# Altium schematic sheet ZX_Main.SchDoc
size A3
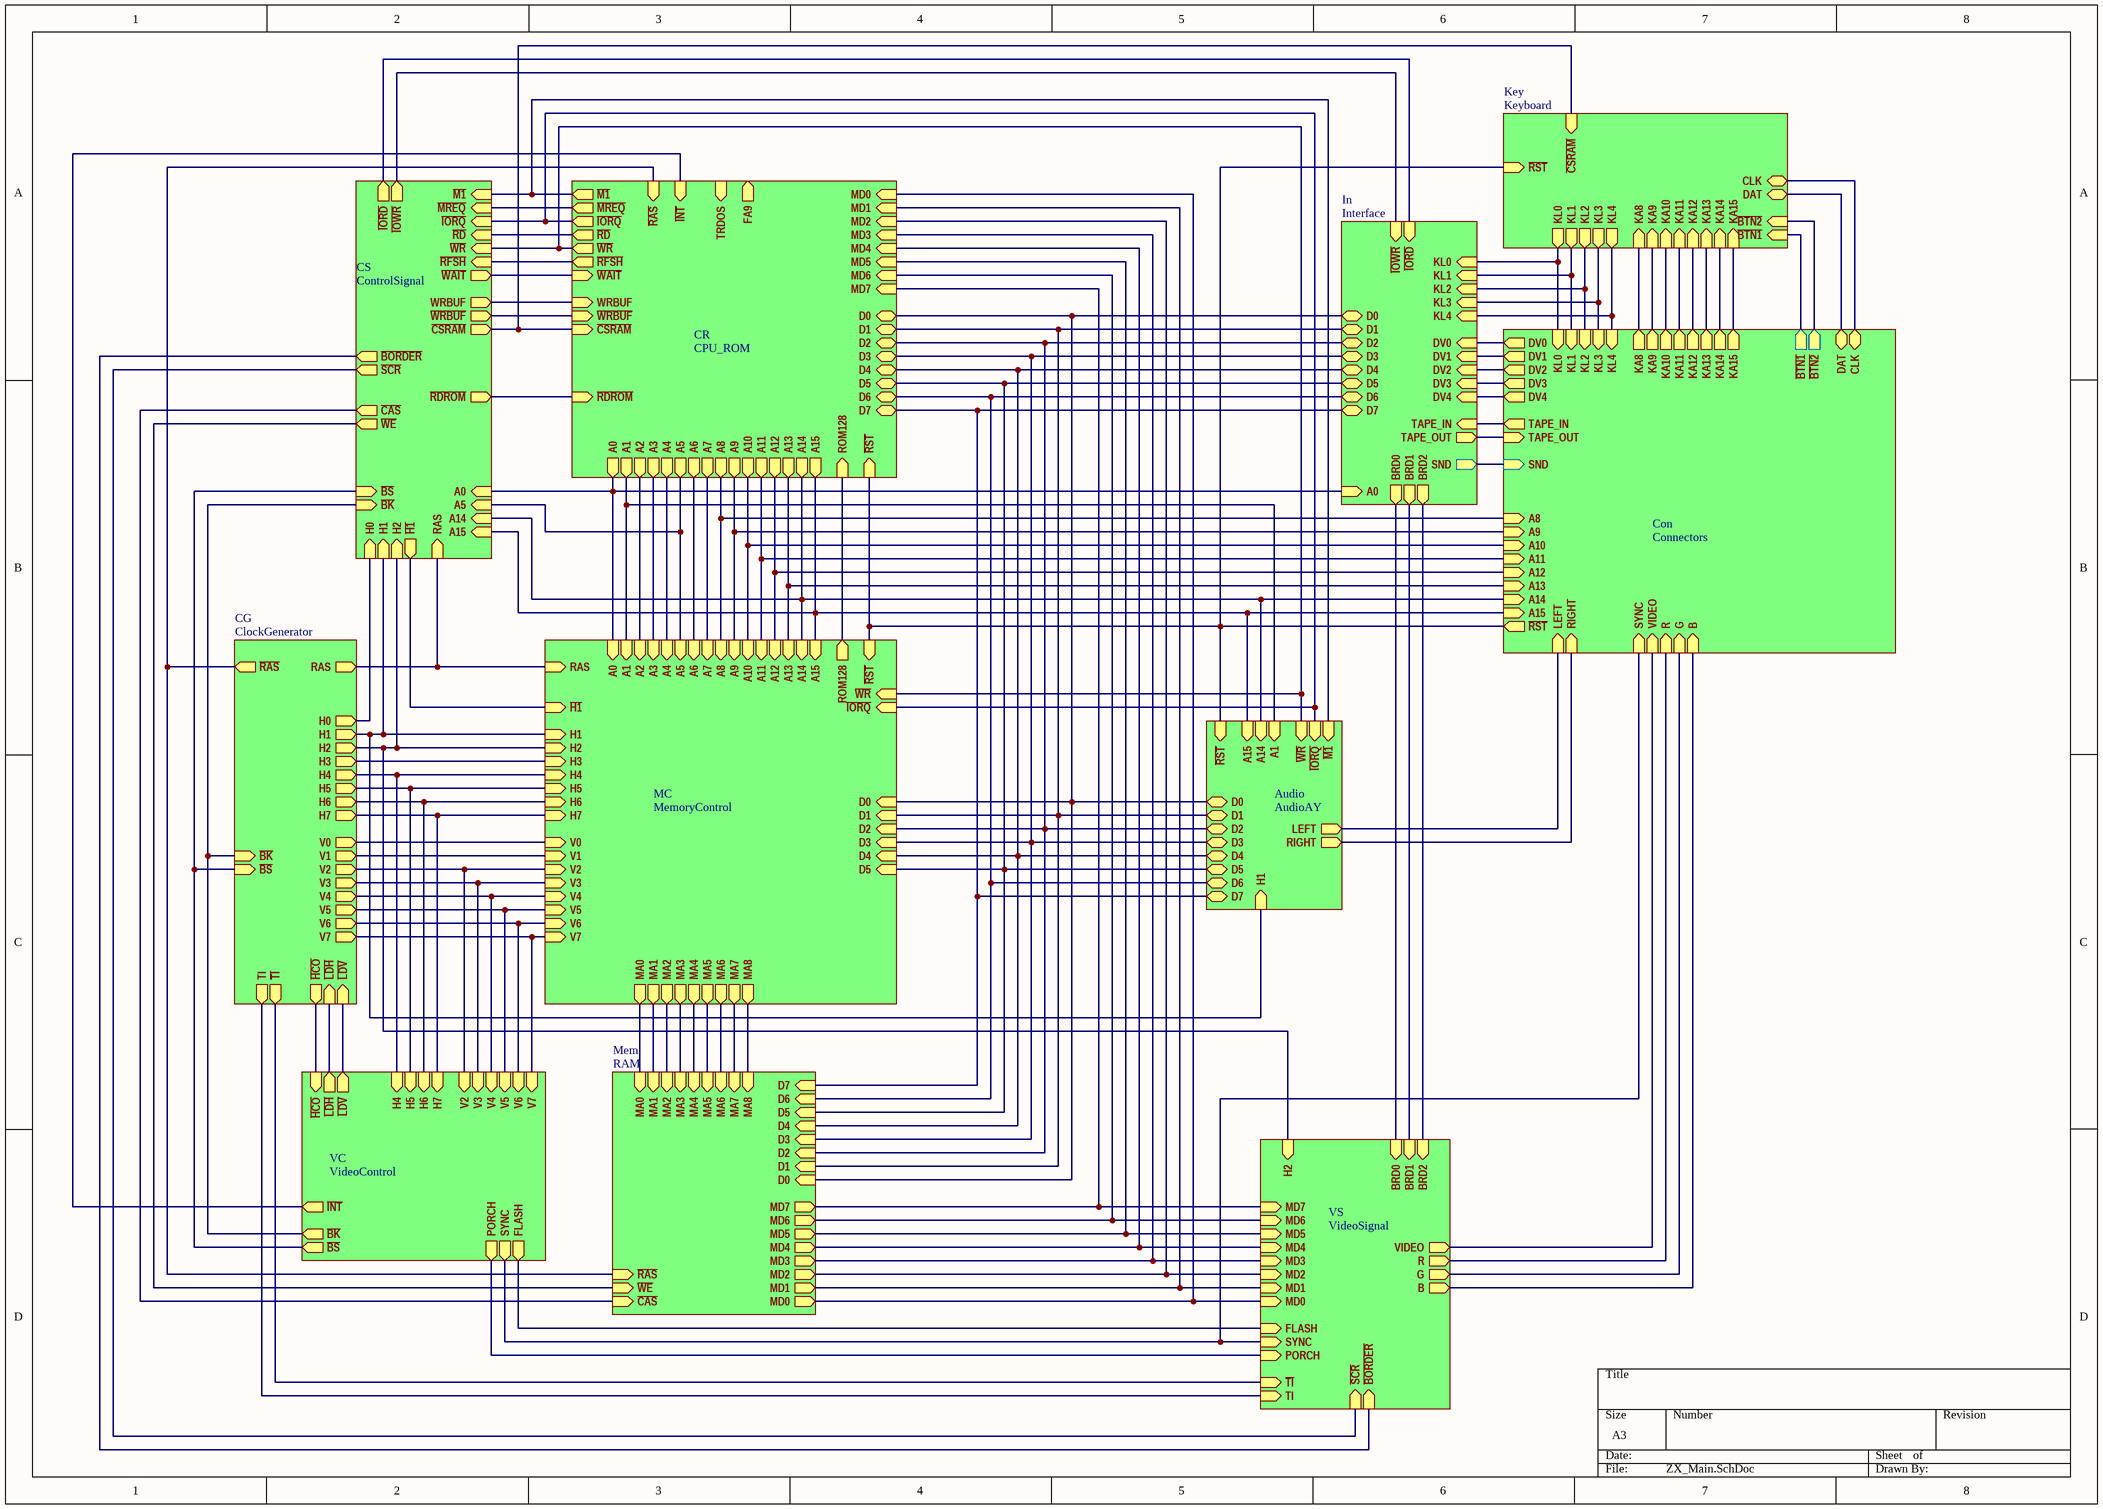
[diagram p0: ZX_Main.SchDoc]

## Sub-sheets
Audio = AudioAY: A15 (in), ~{IORQ} (in), ~{WR} (in), A14 (in), A1 (in), ~{M1} (in), D5 (bidir), D0 (bidir), D6 (bidir), D7 (bidir), D4 (bidir), D3 (bidir), D2 (bidir), D1 (bidir), H1 (in), ~{RST} (in), RIGHT (out), LEFT (out)
CG = ClockGenerator: TI (out), H5 (out), ~{HCO} (out), V5 (out), V4 (out), V7 (out), V0 (out), H2 (out), H0 (out), ~{LDH} (in), H7 (out), ~{RAS} (out), V3 (out), H1 (out), H3 (out), V2 (out), V6 (out), ~{TI} (out), H6 (out), H4 (out), ~{LDV} (in), RAS (out), ~{BK} (in), ~{BS} (in), V1 (out)
Con = Connectors: VIDEO (in), B (in), G (in), R (in), KA14 (out), SYNC (in), ~{RST} (out), LEFT (in), RIGHT (in), DAT (bidir), CLK (bidir), TAPE_IN (out), TAPE_OUT (in), KA15 (out), KA10 (out), KA12 (out), KA11 (out), KA13 (out), KA9 (out), A9 (in), A15 (in), A8 (in), A13 (in), A14 (in), A12 (in), A11 (in), A10 (in), KA8 (out), DV0 (out), DV1 (out), DV4 (out), DV3 (out), DV2 (out), ~{BTN1} (out), ~{BTN2} (out), KL0 (in), KL4 (in), KL1 (in), KL3 (in), KL2 (in), SND (in)
CR = CPU_ROM: ~{RD} (out), ~{WAIT} (in), A0 (out), ~{RDROM} (in), ~{RAS} (in), ~{M1} (out), ~{INT} (in), ~{RFSH} (out), ~{WR} (out), ~{MREQ} (out), ~{RST} (in), MD7 (in), MD6 (in), MD5 (in), MD4 (in), MD3 (in), MD2 (in), MD1 (in), MD0 (in), ~{WRBUF} (in), WRBUF (in), ~{CSRAM} (in), FA9 (out), ~{IORQ} (out), TRDOS (in), ROM128 (in), D7 (bidir), D6 (bidir), D5 (bidir), D4 (bidir), D3 (bidir), D2 (bidir), D1 (bidir), D0 (bidir), A15 (out), A14 (out), A13 (out), A12 (out), A11 (out), A10 (out), A9 (out), A8 (out), A7 (out), A6 (out), A2 (out), A1 (out), A5 (out), A4 (out), A3 (out)
CS = ControlSignal: ~{BS} (in), ~{BK} (in), H0 (in), H1 (in), H2 (in), ~{BORDER} (out), ~{SCR} (out), ~{CAS} (out), ~{WRBUF} (out), WRBUF (out), ~{RD} (in), ~{RFSH} (in), RAS (in), ~{H1} (out), ~{MREQ} (in), A14 (in), A15 (in), ~{WE} (out), ~{RDROM} (out), ~{CSRAM} (out), ~{M1} (in), ~{WAIT} (out), A0 (in), A5 (in), ~{IORQ} (in), ~{WR} (in), ~{IORD} (out), ~{IOWR} (out)
In = Interface: A0 (in), ~{IORD} (in), KL0 (in), KL1 (in), KL2 (in), KL3 (in), KL4 (in), DV0 (in), DV1 (in), DV2 (in), D0, D1, D2, DV3 (in), DV4 (in), D3, D4, D5, D6, D7, ~{IOWR} (in), BRD0 (out), BRD1 (out), BRD2 (out), TAPE_IN (in), TAPE_OUT (out), SND (out)
Key = Keyboard: KA13 (in), ~{CSRAM} (in), KA15 (in), KL2 (out), ~{RST} (in), KA12 (in), KL3 (out), KA14 (in), KL4 (out), KA8 (in), KA11 (in), CLK (bidir), ~{BTN1} (in), KA10 (in), KA9 (in), DAT (bidir), ~{BTN2} (in), KL0 (out), KL1 (out)
MC = MemoryControl: MA1 (out), MA0 (out), MA8 (out), V4 (in), MA4 (out), MA3 (out), RAS (in), V2 (in), ~{H1} (in), MA7 (out), A1 (in), H5 (in), V1 (in), H1 (in), H2 (in), V3 (in), MA6 (out), V0 (in), MA5 (out), V7 (in), V6 (in), H6 (in), MA2 (out), V5 (in), A0 (in), H7 (in), H4 (in), H3 (in), A2 (in), A3 (in), A4 (in), A5 (in), A6 (in), A7 (in), A8 (in), A9 (in), A10 (in), A11 (in), A12 (in), A13 (in), A14 (in), A15 (in), ~{RST} (in), D0 (in), D1 (in), D2 (in), D3 (in), D4 (in), D5 (in), ~{WR} (in), ~{IORQ} (in), ROM128 (out)
Mem = RAM: D6 (in), D1 (in), D0 (in), MD0 (out), D4 (in), MD7 (out), D7 (in), D5 (in), MD3 (out), MD1 (out), D2 (in), D3 (in), MD2 (out), MD4 (out), MD5 (out), MD6 (out), ~{WE} (in), ~{CAS} (in), ~{RAS} (in), MA8 (in), MA7 (in), MA6 (in), MA5 (in), MA4 (in), MA2 (in), MA1 (in), MA0 (in), MA3 (in)
VC = VideoControl: H7 (in), H6 (in), H5 (in), ~{HCO} (in), ~{LDH} (out), ~{BS} (out), PORCH (out), SYNC (out), V4 (in), V7 (in), ~{LDV} (out), H4 (in), V5 (in), V6 (in), V2 (in), V3 (in), ~{BK} (out), FLASH (out), ~{INT} (out)
VS = VideoSignal: H2 (in), MD6 (in), SYNC (in), MD5 (in), MD3 (in), MD1 (in), TI (in), ~{SCR} (in), FLASH (in), ~{TI} (in), MD0 (in), MD2 (in), MD4 (in), PORCH (in), ~{BORDER} (in), MD7 (in), G (out), R (out), B (out), VIDEO (out), BRD2 (in), BRD1 (in), BRD0 (in)

## Nets
(unnamed): sheet CG/TI, sheet VS/TI
(unnamed): sheet CG/H5, sheet VC/H5, sheet MC/H5
(unnamed): sheet CG/~{HCO}, sheet VC/~{HCO}
(unnamed): sheet CG/V5, sheet VC/V5, sheet MC/V5
(unnamed): sheet CG/V4, sheet VC/V4, sheet MC/V4
(unnamed): sheet CG/V7, sheet VC/V7, sheet MC/V7
(unnamed): sheet CG/V0, sheet MC/V0
(unnamed): sheet CG/H2, sheet CS/H2, sheet VS/H2, sheet MC/H2
(unnamed): sheet CG/H0, sheet CS/H0
(unnamed): sheet CG/~{LDH}, sheet VC/~{LDH}
(unnamed): sheet CG/H7, sheet VC/H7, sheet MC/H7
(unnamed): sheet CG/~{RAS}, sheet CR/~{RAS}, sheet Mem/~{RAS}
(unnamed): sheet CG/V3, sheet VC/V3, sheet MC/V3
(unnamed): sheet CG/H1, sheet CS/H1, sheet MC/H1, sheet Audio/H1
(unnamed): sheet CG/H3, sheet MC/H3
(unnamed): sheet CG/V2, sheet VC/V2, sheet MC/V2
(unnamed): sheet CG/V6, sheet VC/V6, sheet MC/V6
(unnamed): sheet CG/~{TI}, sheet VS/~{TI}
(unnamed): sheet CG/H6, sheet VC/H6, sheet MC/H6
(unnamed): sheet CG/H4, sheet VC/H4, sheet MC/H4
(unnamed): sheet CG/~{LDV}, sheet VC/~{LDV}
(unnamed): sheet CG/RAS, sheet CS/RAS, sheet MC/RAS
(unnamed): sheet CG/~{BK}, sheet CS/~{BK}, sheet VC/~{BK}
(unnamed): sheet CG/~{BS}, sheet CS/~{BS}, sheet VC/~{BS}
(unnamed): sheet CG/V1, sheet MC/V1
(unnamed): sheet CS/~{BORDER}, sheet VS/~{BORDER}
(unnamed): sheet CS/~{SCR}, sheet VS/~{SCR}
(unnamed): sheet CS/~{CAS}, sheet Mem/~{CAS}
(unnamed): sheet CS/~{WRBUF}, sheet CR/~{WRBUF}
(unnamed): sheet CS/WRBUF, sheet CR/WRBUF
(unnamed): sheet CS/~{RD}, sheet CR/~{RD}
(unnamed): sheet CS/~{RFSH}, sheet CR/~{RFSH}
(unnamed): sheet CS/~{H1}, sheet MC/~{H1}
(unnamed): sheet CS/~{MREQ}, sheet CR/~{MREQ}
(unnamed): sheet CS/A14, sheet CR/A14, sheet MC/A14, sheet Audio/A14, sheet Con/A14
(unnamed): sheet CS/A15, sheet CR/A15, sheet MC/A15, sheet Audio/A15, sheet Con/A15
(unnamed): sheet CS/~{WE}, sheet Mem/~{WE}
(unnamed): sheet CS/~{RDROM}, sheet CR/~{RDROM}
(unnamed): sheet CS/~{CSRAM}, sheet CR/~{CSRAM}, sheet Key/~{CSRAM}
(unnamed): sheet CS/~{M1}, sheet CR/~{M1}, sheet Audio/~{M1}
(unnamed): sheet CS/~{WAIT}, sheet CR/~{WAIT}
(unnamed): sheet CS/A0, sheet CR/A0, sheet MC/A0, sheet In/A0
(unnamed): sheet CS/A5, sheet CR/A5, sheet MC/A5
(unnamed): sheet CS/~{IORQ}, sheet CR/~{IORQ}, sheet MC/~{IORQ}, sheet Audio/~{IORQ}
(unnamed): sheet CS/~{WR}, sheet CR/~{WR}, sheet MC/~{WR}, sheet Audio/~{WR}
(unnamed): sheet CS/~{IORD}, sheet In/~{IORD}
(unnamed): sheet CS/~{IOWR}, sheet In/~{IOWR}
(unnamed): sheet VC/PORCH, sheet VS/PORCH
(unnamed): sheet VC/SYNC, sheet VS/SYNC, sheet Con/SYNC
(unnamed): sheet VC/FLASH, sheet VS/FLASH
(unnamed): sheet VC/~{INT}, sheet CR/~{INT}
(unnamed): sheet VS/MD6, sheet CR/MD6, sheet Mem/MD6
(unnamed): sheet VS/MD5, sheet CR/MD5, sheet Mem/MD5
(unnamed): sheet VS/MD3, sheet CR/MD3, sheet Mem/MD3
(unnamed): sheet VS/MD1, sheet CR/MD1, sheet Mem/MD1
(unnamed): sheet VS/MD0, sheet CR/MD0, sheet Mem/MD0
(unnamed): sheet VS/MD2, sheet CR/MD2, sheet Mem/MD2
(unnamed): sheet VS/MD4, sheet CR/MD4, sheet Mem/MD4
(unnamed): sheet VS/MD7, sheet CR/MD7, sheet Mem/MD7
(unnamed): sheet VS/G, sheet Con/G
(unnamed): sheet VS/R, sheet Con/R
(unnamed): sheet VS/B, sheet Con/B
(unnamed): sheet VS/VIDEO, sheet Con/VIDEO
(unnamed): sheet VS/BRD2, sheet In/BRD2
(unnamed): sheet VS/BRD1, sheet In/BRD1
(unnamed): sheet VS/BRD0, sheet In/BRD0
(unnamed): sheet CR/~{RST}, sheet MC/~{RST}, sheet Key/~{RST}, sheet Audio/~{RST}, sheet Con/~{RST}
(unnamed): sheet CR/ROM128, sheet MC/ROM128
(unnamed): sheet CR/D7, sheet Mem/D7, sheet Audio/D7, sheet In/D7
(unnamed): sheet CR/D6, sheet Mem/D6, sheet Audio/D6, sheet In/D6
(unnamed): sheet CR/D5, sheet MC/D5, sheet Mem/D5, sheet Audio/D5, sheet In/D5
(unnamed): sheet CR/D4, sheet MC/D4, sheet Mem/D4, sheet Audio/D4, sheet In/D4
(unnamed): sheet CR/D3, sheet MC/D3, sheet Mem/D3, sheet Audio/D3, sheet In/D3
(unnamed): sheet CR/D2, sheet MC/D2, sheet Mem/D2, sheet Audio/D2, sheet In/D2
(unnamed): sheet CR/D1, sheet MC/D1, sheet Mem/D1, sheet Audio/D1, sheet In/D1
(unnamed): sheet CR/D0, sheet MC/D0, sheet Mem/D0, sheet Audio/D0, sheet In/D0
(unnamed): sheet CR/A13, sheet MC/A13, sheet Con/A13
(unnamed): sheet CR/A12, sheet MC/A12, sheet Con/A12
(unnamed): sheet CR/A11, sheet MC/A11, sheet Con/A11
(unnamed): sheet CR/A10, sheet MC/A10, sheet Con/A10
(unnamed): sheet CR/A9, sheet MC/A9, sheet Con/A9
(unnamed): sheet CR/A8, sheet MC/A8, sheet Con/A8
(unnamed): sheet CR/A7, sheet MC/A7
(unnamed): sheet CR/A6, sheet MC/A6
(unnamed): sheet CR/A2, sheet MC/A2
(unnamed): sheet CR/A1, sheet MC/A1, sheet Audio/A1
(unnamed): sheet CR/A4, sheet MC/A4
(unnamed): sheet CR/A3, sheet MC/A3
(unnamed): sheet MC/MA1, sheet Mem/MA1
(unnamed): sheet MC/MA0, sheet Mem/MA0
(unnamed): sheet MC/MA8, sheet Mem/MA8
(unnamed): sheet MC/MA4, sheet Mem/MA4
(unnamed): sheet MC/MA3, sheet Mem/MA3
(unnamed): sheet MC/MA7, sheet Mem/MA7
(unnamed): sheet MC/MA6, sheet Mem/MA6
(unnamed): sheet MC/MA5, sheet Mem/MA5
(unnamed): sheet MC/MA2, sheet Mem/MA2
(unnamed): sheet Key/KA13, sheet Con/KA13
(unnamed): sheet Key/KA15, sheet Con/KA15
(unnamed): sheet Key/KL2, sheet In/KL2, sheet Con/KL2
(unnamed): sheet Key/KA12, sheet Con/KA12
(unnamed): sheet Key/KL3, sheet In/KL3, sheet Con/KL3
(unnamed): sheet Key/KA14, sheet Con/KA14
(unnamed): sheet Key/KL4, sheet In/KL4, sheet Con/KL4
(unnamed): sheet Key/KA8, sheet Con/KA8
(unnamed): sheet Key/KA11, sheet Con/KA11
(unnamed): sheet Key/CLK, sheet Con/CLK
(unnamed): sheet Key/~{BTN1}, sheet Con/~{BTN1}
(unnamed): sheet Key/KA10, sheet Con/KA10
(unnamed): sheet Key/KA9, sheet Con/KA9
(unnamed): sheet Key/DAT, sheet Con/DAT
(unnamed): sheet Key/~{BTN2}, sheet Con/~{BTN2}
(unnamed): sheet Key/KL0, sheet In/KL0, sheet Con/KL0
(unnamed): sheet Key/KL1, sheet In/KL1, sheet Con/KL1
(unnamed): sheet Audio/RIGHT, sheet Con/RIGHT
(unnamed): sheet Audio/LEFT, sheet Con/LEFT
(unnamed): sheet In/DV0, sheet Con/DV0
(unnamed): sheet In/DV1, sheet Con/DV1
(unnamed): sheet In/DV2, sheet Con/DV2
(unnamed): sheet In/DV3, sheet Con/DV3
(unnamed): sheet In/DV4, sheet Con/DV4
(unnamed): sheet In/TAPE_IN, sheet Con/TAPE_IN
(unnamed): sheet In/TAPE_OUT, sheet Con/TAPE_OUT
(unnamed): sheet In/SND, sheet Con/SND